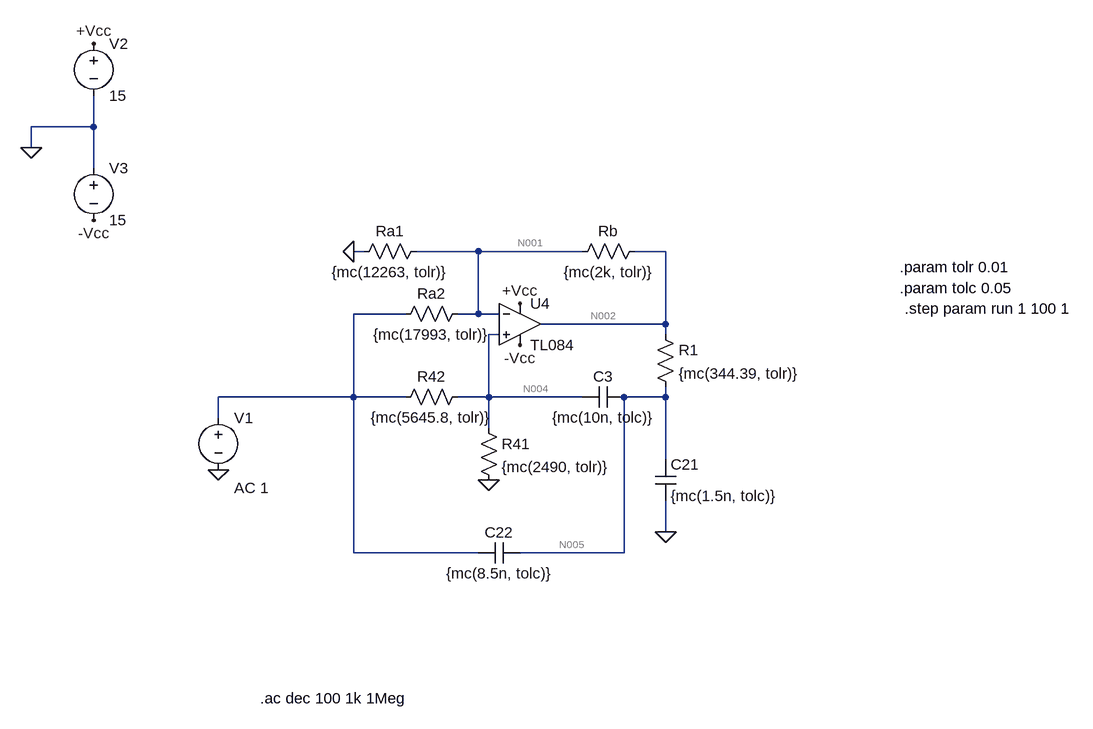
[diagram p0: schematic Sedra_MC_etapa2.asc]
Sedra_MC_etapa2.asc, the LTspice schematic file:
Version 4
SHEET 1 1996 680
WIRE -192 -480 -192 -528
WIRE -192 -480 -288 -480
WIRE -288 -448 -288 -480
WIRE -192 -416 -192 -480
WIRE 224 -288 208 -288
WIRE 400 -288 304 -288
WIRE 560 -288 400 -288
WIRE 688 -288 640 -288
WIRE 288 -192 208 -192
WIRE 400 -192 400 -288
WIRE 400 -192 368 -192
WIRE 432 -192 400 -192
WIRE 688 -176 688 -288
WIRE 688 -176 496 -176
WIRE 432 -160 416 -160
WIRE 688 -160 688 -176
WIRE 208 -64 208 -192
WIRE 208 -64 0 -64
WIRE 288 -64 208 -64
WIRE 416 -64 416 -160
WIRE 416 -64 368 -64
WIRE 560 -64 416 -64
WIRE 688 -64 688 -80
WIRE 688 -64 624 -64
WIRE 0 -32 0 -64
WIRE 416 -16 416 -64
WIRE 688 32 688 -64
WIRE 688 144 688 96
WIRE 208 176 208 -64
WIRE 400 176 208 176
WIRE 624 176 624 -64
WIRE 624 176 464 176
FLAG 0 48 0
FLAG 416 64 0
FLAG 208 -288 0
FLAG 688 144 0
FLAG -288 -448 0
FLAG 464 -208 +Vcc
FLAG 464 -144 -Vcc
FLAG -192 -608 +Vcc
FLAG -192 -336 -Vcc
SYMBOL voltage 0 -48 R0
WINDOW 123 24 124 Left 2
WINDOW 39 0 0 Left 0
SYMATTR Value2 AC 1
SYMATTR InstName V1
SYMATTR Value ""
SYMBOL res 384 -80 R90
WINDOW 0 0 56 VBottom 2
WINDOW 3 32 56 VTop 2
SYMATTR InstName R42
SYMATTR Value {mc(5645.8, tolr)}
SYMBOL res 384 -208 R90
WINDOW 0 0 56 VBottom 2
WINDOW 3 32 56 VTop 2
SYMATTR InstName Ra2
SYMATTR Value {mc(17993, tolr)}
SYMBOL res 400 -32 R0
SYMATTR InstName R41
SYMATTR Value {mc(2490, tolr)}
SYMBOL cap 624 -80 R90
WINDOW 0 0 32 VBottom 2
WINDOW 3 32 32 VTop 2
SYMATTR InstName C3
SYMATTR Value {mc(10n, tolc)}
SYMBOL cap 464 160 R90
WINDOW 0 0 32 VBottom 2
WINDOW 3 32 32 VTop 2
SYMATTR InstName C22
SYMATTR Value {mc(8.5n, tolc)}
SYMBOL res 320 -304 R90
WINDOW 0 0 56 VBottom 2
WINDOW 3 32 56 VTop 2
SYMATTR InstName Ra1
SYMATTR Value {mc(12263, tolr)}
SYMBOL res 656 -304 R90
WINDOW 0 0 56 VBottom 2
WINDOW 3 32 56 VTop 2
SYMATTR InstName Rb
SYMATTR Value {mc(2k, tolr)}
SYMBOL cap 672 32 R0
SYMATTR InstName C21
SYMATTR Value {mc(1.5n, tolc)}
SYMBOL voltage -192 -624 R0
WINDOW 123 0 0 Left 0
WINDOW 39 0 0 Left 0
SYMATTR InstName V2
SYMATTR Value 15
SYMBOL voltage -192 -432 R0
WINDOW 123 0 0 Left 0
WINDOW 39 0 0 Left 0
SYMATTR InstName V3
SYMATTR Value 15
SYMBOL res 672 -176 R0
SYMATTR InstName R1
SYMATTR Value {mc(344.39, tolr)}
SYMBOL sympropio\\TL084 464 -240 R0
SYMATTR InstName U4
TEXT 64 400 Left 2 !.ac dec 100 1k 1Meg
TEXT 1048 -264 Left 2 !.param tolr 0.01
TEXT 1048 -232 Left 2 !.param tolc 0.05
TEXT 1056 -200 Left 2 !.step param run 1 100 1

The netlist it stands for:
* Sedra_MC_etapa2.asc
V1 N003 0 AC 1
R42 N004 N003 {mc(5645.8, tolr)}
Ra2 N001 N003 {mc(17993, tolr)}
R41 N004 0 {mc(2490, tolr)}
C3 N005 N004 {mc(10n, tolc)}
C22 N005 N003 {mc(8.5n, tolc)}
Ra1 N001 0 {mc(12263, tolr)}
Rb N002 N001 {mc(2k, tolr)}
C21 N005 0 {mc(1.5n, tolc)}
V2 +Vcc 0 15
V3 0 -Vcc 15
R1 N002 N005 {mc(344.39, tolr)}
* U4: TL084 (symbol sympropio\TL084 not available, pins judged from their places): In+=N004 In-=N001 V+=+Vcc V-=-Vcc OUT=N002
.ac dec 100 1k 1Meg
.param tolr 0.01
.param tolc 0.05
.step param run 1 100 1
.backanno
.end

* Results of the author's LTspice run, read from the files saved beside the schematic
* Operating Point (first step), zero values left out:
*   run = 1 
*   V(n004) = -77.28 nV
*   V(n001) = 10.89 µV
*   V(n005) = 13.96 µV
*   V(n002) = 13.96 µV
*   V(+vcc) = 15 V
*   V(-vcc) = -15 V
*   I(Rb) = 1.538 nA
*   I(Ra1) = 888.7 pA
*   I(R41) = -31.23 pA
*   I(Ra2) = 604.7 pA
*   I(R42) = -13.83 pA
*   I(V3) = -14.19 mA
*   I(V2) = -14.19 mA
*   I(V1) = 590.8 pA
*   Ix(u4:1) = 45.05 pA
*   Ix(u4:2) = 45.05 pA
*   Ix(u4:3) = 14.19 mA
*   Ix(u4:4) = -14.19 mA
*   Ix(u4:5) = -1.538 nA